# Altium schematic sheet accelero.SchDoc
size A
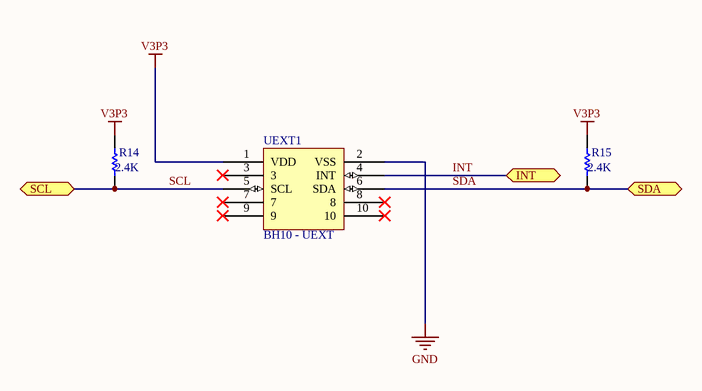
[diagram p0: accelero.SchDoc]

## Parts
R14  value 2.4K  [RESISTANCE]  (hidden comment: Res1)
R15  value 2.4K  [RESISTANCE]  (hidden comment: Res1)
UEXT1  BH10 - UEXT  [ACCELERO]

## Ports
INT (bidir), SCL (bidir), SDA (bidir)

## Nets
GND: UEXT1.2(VSS)
V3P3: R14.2 R15.2 UEXT1.1(VDD)
INT: UEXT1.4(INT) ; port INT
SCL: R14.1 UEXT1.5(SCL) ; port SCL
SDA: R15.1 UEXT1.6(SDA) ; port SDA

Not connected (* = marked no-connect by the designer): UEXT1 3* 7* 8* 9* 10*

## Library data of the parts
R14 R15 = Res1: Resistor; Published: 8-Jun-2000; LatestRevisionDate: 17-Jul-2002; LatestRevisionNote: Re-released for DXP Platform.; PackageReference: AXIAL-0.3; Publisher: Altium Limited; PackageDescription: Axial Device, Thru-Hole; 2 Leads; 0.3 in Pin Spacing
UEXT1 = BH10 - UEXT: Connection accelero module